# Altium schematic sheet LED_brick.SchDoc
size A4
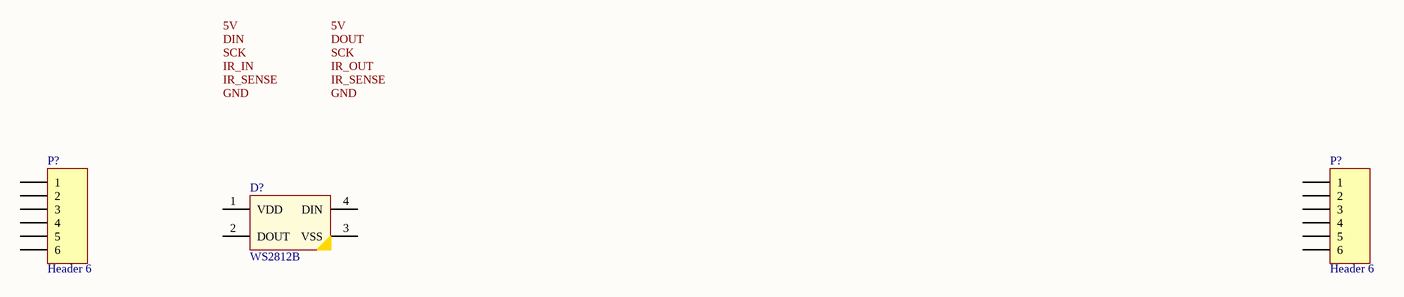
[diagram p0: LED_brick.SchDoc]

## Parts
(Parts that share a designator on the sheet are numbered #1, #2 ... from top to bottom, then left to right.)
D?  WS2812B  [LED_5050_4pin]
P?#1  Header 6  [HDR1X6]
P?#2  Header 6  [HDR1X6]

## Nets

Not connected (* = marked no-connect by the designer): D? 1(VDD) 2(DOUT) 3(VSS) 4(DIN); P?#1 1 2 3 4 5 6; P?#2 1 2 3 4 5 6

## Notes on the sheet
- Labels drawn without touching a wire or pin: 5V, DIN, DOUT, GND, IR_IN, IR_OUT, IR_SENSE, SCK

## Library data of the parts
P?#1 P?#2 = Header 6: Header, 6-Pin; LatestRevisionDate: 17-Jul-2002; LatestRevisionNote: Re-released for DXP Platform.; Publisher: Altium Limited